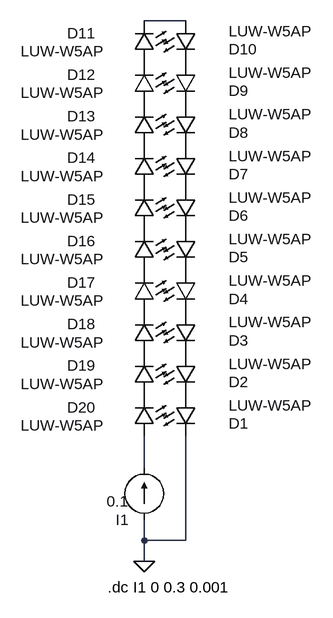
[diagram p0: schematic LEDEquivalentTest.asc]
LEDEquivalentTest.asc, the LTspice schematic file:
Version 4
SHEET 1 880 680
WIRE 240 -416 176 -416
WIRE 176 272 176 224
WIRE 176 384 176 352
WIRE 240 384 240 224
WIRE 240 384 176 384
WIRE 176 416 176 384
FLAG 176 416 0
SYMBOL current 176 352 R180
WINDOW 3 24 28 Left 2
WINDOW 123 0 0 Left 2
WINDOW 39 0 0 Left 2
SYMATTR Value 0.1
SYMATTR InstName I1
SYMBOL LED 224 160 R0
WINDOW 0 82 44 Left 2
WINDOW 3 82 16 Left 2
SYMATTR InstName D1
SYMATTR Value LUW-W5AP
SYMBOL LED 224 96 R0
WINDOW 0 82 44 Left 2
WINDOW 3 82 16 Left 2
SYMATTR InstName D2
SYMATTR Value LUW-W5AP
SYMBOL LED 224 32 R0
WINDOW 0 82 44 Left 2
WINDOW 3 82 16 Left 2
SYMATTR InstName D3
SYMATTR Value LUW-W5AP
SYMBOL LED 224 -32 R0
WINDOW 0 82 44 Left 2
WINDOW 3 82 16 Left 2
SYMATTR InstName D4
SYMATTR Value LUW-W5AP
SYMBOL LED 224 -96 R0
WINDOW 0 82 44 Left 2
WINDOW 3 82 16 Left 2
SYMATTR InstName D5
SYMATTR Value LUW-W5AP
SYMBOL LED 224 -160 R0
WINDOW 0 82 44 Left 2
WINDOW 3 82 16 Left 2
SYMATTR InstName D6
SYMATTR Value LUW-W5AP
SYMBOL LED 224 -224 R0
WINDOW 0 82 44 Left 2
WINDOW 3 82 16 Left 2
SYMATTR InstName D7
SYMATTR Value LUW-W5AP
SYMBOL LED 224 -288 R0
WINDOW 0 82 44 Left 2
WINDOW 3 82 16 Left 2
SYMATTR InstName D8
SYMATTR Value LUW-W5AP
SYMBOL LED 224 -352 R0
WINDOW 0 82 44 Left 2
WINDOW 3 82 16 Left 2
SYMATTR InstName D9
SYMATTR Value LUW-W5AP
SYMBOL LED 224 -416 R0
WINDOW 0 82 44 Left 2
WINDOW 3 82 16 Left 2
SYMATTR InstName D10
SYMATTR Value LUW-W5AP
SYMBOL LED 192 -352 R180
WINDOW 0 90 45 Left 2
WINDOW 3 77 17 Left 2
SYMATTR InstName D11
SYMATTR Value LUW-W5AP
SYMBOL LED 192 -288 R180
WINDOW 0 90 45 Left 2
WINDOW 3 77 17 Left 2
SYMATTR InstName D12
SYMATTR Value LUW-W5AP
SYMBOL LED 192 -224 R180
WINDOW 0 90 45 Left 2
WINDOW 3 77 17 Left 2
SYMATTR InstName D13
SYMATTR Value LUW-W5AP
SYMBOL LED 192 -160 R180
WINDOW 0 90 45 Left 2
WINDOW 3 77 17 Left 2
SYMATTR InstName D14
SYMATTR Value LUW-W5AP
SYMBOL LED 192 -96 R180
WINDOW 0 90 45 Left 2
WINDOW 3 77 17 Left 2
SYMATTR InstName D15
SYMATTR Value LUW-W5AP
SYMBOL LED 192 -32 R180
WINDOW 0 90 45 Left 2
WINDOW 3 77 17 Left 2
SYMATTR InstName D16
SYMATTR Value LUW-W5AP
SYMBOL LED 192 32 R180
WINDOW 0 90 45 Left 2
WINDOW 3 77 17 Left 2
SYMATTR InstName D17
SYMATTR Value LUW-W5AP
SYMBOL LED 192 96 R180
WINDOW 0 90 45 Left 2
WINDOW 3 77 17 Left 2
SYMATTR InstName D18
SYMATTR Value LUW-W5AP
SYMBOL LED 192 160 R180
WINDOW 0 90 45 Left 2
WINDOW 3 77 17 Left 2
SYMATTR InstName D19
SYMATTR Value LUW-W5AP
SYMBOL LED 192 224 R180
WINDOW 0 90 45 Left 2
WINDOW 3 77 17 Left 2
SYMATTR InstName D20
SYMATTR Value LUW-W5AP
TEXT 120 456 Left 2 !.dc I1 0 0.3 0.001

The netlist it stands for:
* LEDEquivalentTest.asc
I1 0 N002 0.1
D1 P001 0 LUW-W5AP
D2 P002 P001 LUW-W5AP
D3 P003 P002 LUW-W5AP
D4 P004 P003 LUW-W5AP
D5 P005 P004 LUW-W5AP
D6 P006 P005 LUW-W5AP
D7 P007 P006 LUW-W5AP
D8 P008 P007 LUW-W5AP
D9 P009 P008 LUW-W5AP
D10 N001 P009 LUW-W5AP
D11 P010 N001 LUW-W5AP
D12 P011 P010 LUW-W5AP
D13 P012 P011 LUW-W5AP
D14 P013 P012 LUW-W5AP
D15 P014 P013 LUW-W5AP
D16 P015 P014 LUW-W5AP
D17 P016 P015 LUW-W5AP
D18 P017 P016 LUW-W5AP
D19 P018 P017 LUW-W5AP
D20 N002 P018 LUW-W5AP
.model D D
.lib standard.dio
.dc I1 0 0.3 0.001
.backanno
.end